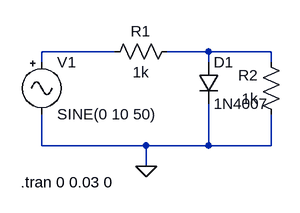
[diagram p0: schematic AEkg3Opgv1.asc]
AEkg3Opgv1.asc, the LTspice schematic file:
Version 4
SHEET 1 880 680
WIRE 80 128 -32 128
WIRE 224 128 160 128
WIRE 320 128 224 128
WIRE -32 144 -32 128
WIRE 224 144 224 128
WIRE 320 144 320 128
WIRE -32 272 -32 224
WIRE 128 272 -32 272
WIRE 224 272 224 208
WIRE 224 272 128 272
WIRE 320 272 320 224
WIRE 320 272 224 272
WIRE 128 304 128 272
FLAG 128 304 0
SYMBOL res 176 112 R90
WINDOW 0 0 56 VBottom 2
WINDOW 3 32 56 VTop 2
SYMATTR InstName R1
SYMATTR Value 1k
SYMBOL res 336 240 R180
WINDOW 0 36 76 Left 2
WINDOW 3 36 40 Left 2
SYMATTR InstName R2
SYMATTR Value 1k
SYMBOL diode 208 144 R0
SYMATTR InstName D1
SYMATTR Value 1N4007
SYMBOL Misc\\signal -32 128 R0
WINDOW 123 0 0 Left 0
WINDOW 39 0 0 Left 0
SYMATTR InstName V1
SYMATTR Value SINE(0 10 50)
TEXT -64 328 Left 2 !.tran 0 0.03 0

The netlist it stands for:
* AEkg3Opgv1.asc
R1 N002 N001 1k
R2 0 N002 1k
D1 N002 0 1N4007
V1 N001 0 SINE(0 10 50)
.model D D
.lib standard.dio
.tran 0 0.03 0
.backanno
.end